# Altium schematic sheet iDAC2.SchDoc: Laser PCB
size A3; DrawnBy: James Singleton; Organization: TMC Technology Ltd.; DocumentNumber: 3; Revision: A; SheetNumber: 4; SheetTotal: 18; Drawn Date: 22/12/2020
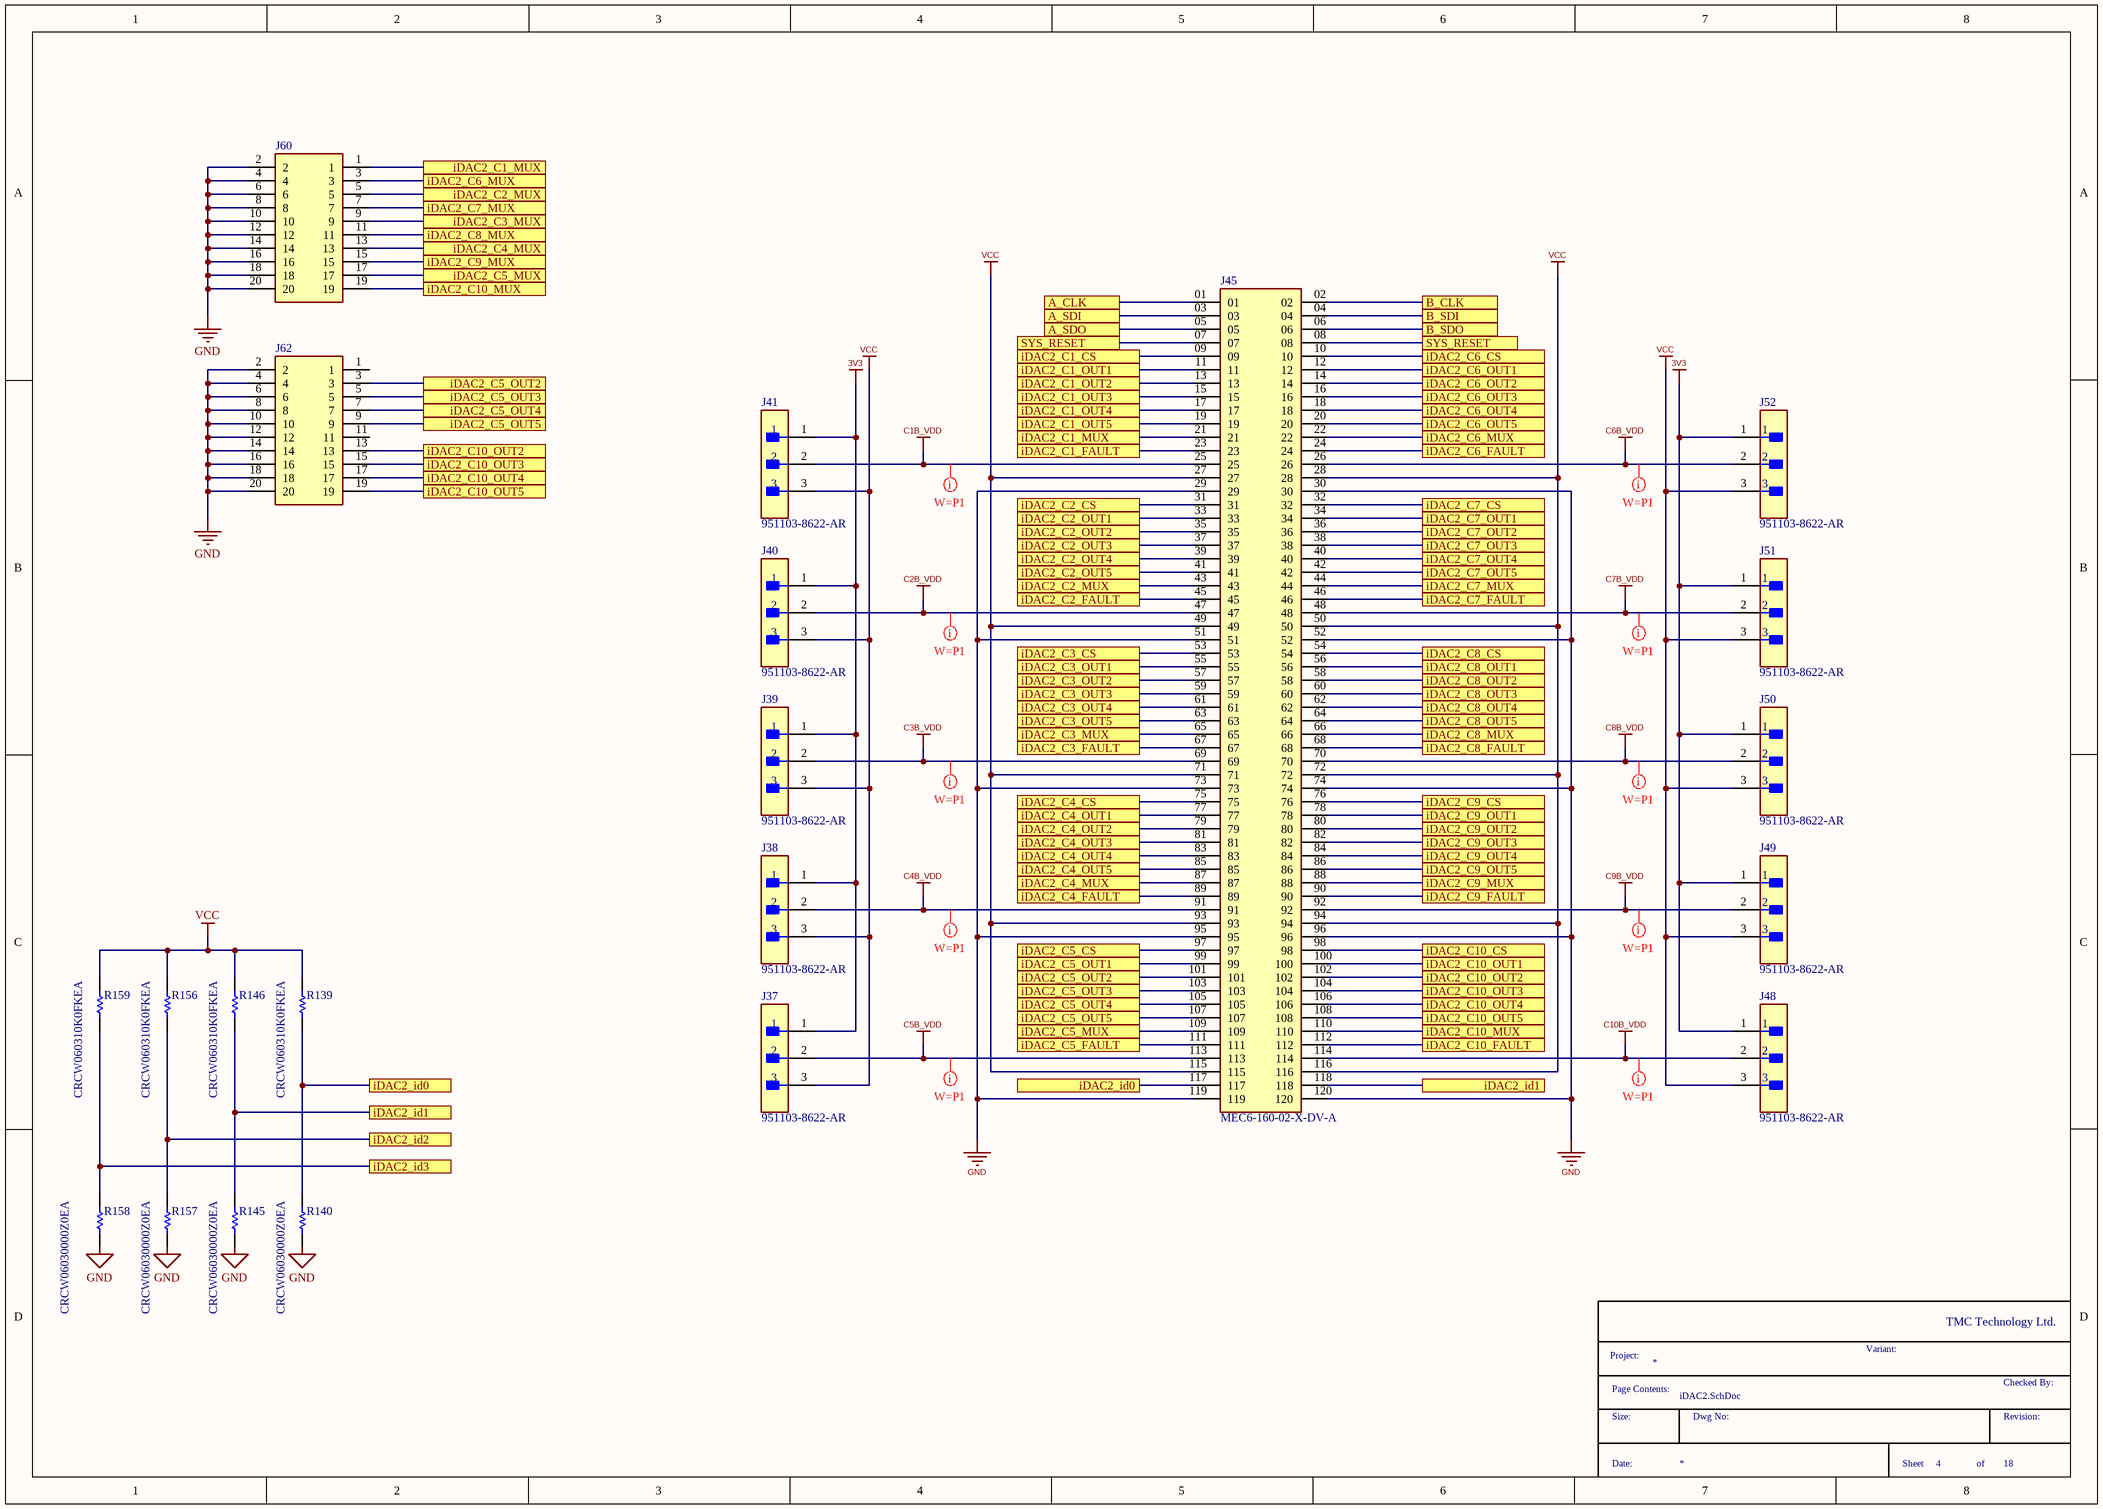
[diagram p0: iDAC2.SchDoc]

## Parts
J37  951103-8622-AR  [FP-951103-8622-AR-MFG]
J38  951103-8622-AR  [FP-951103-8622-AR-MFG]
J39  951103-8622-AR  [FP-951103-8622-AR-MFG]
J40  951103-8622-AR  [FP-951103-8622-AR-MFG]
J41  951103-8622-AR  [FP-951103-8622-AR-MFG]
J45  MEC6-160-02-X-DV-A  [SAMTEC_MEC6-160-02-X-DV-A]
J48  951103-8622-AR  [FP-951103-8622-AR-MFG]
J49  951103-8622-AR  [FP-951103-8622-AR-MFG]
J50  951103-8622-AR  [FP-951103-8622-AR-MFG]
J51  951103-8622-AR  [FP-951103-8622-AR-MFG]
J52  951103-8622-AR  [FP-951103-8622-AR-MFG]
J60  (no value)  [HDRV20W40P127_2X10_1270X340X550P]
J62  (no value)  [HDRV20W40P127_2X10_1270X340X550P]
R139  CRCW060310K0FKEA  [RESC1609X50X30NL8T20]
R140  CRCW06030000Z0EA  [RESC1609X50X30NL8T20]
R145  CRCW06030000Z0EA  [RESC1609X50X30NL8T20]
R146  CRCW060310K0FKEA  [RESC1609X50X30NL8T20]
R156  CRCW060310K0FKEA  [RESC1609X50X30NL8T20]
R157  CRCW06030000Z0EA  [RESC1609X50X30NL8T20]
R158  CRCW06030000Z0EA  [RESC1609X50X30NL8T20]
R159  CRCW060310K0FKEA  [RESC1609X50X30NL8T20]

## Ports
A_CLK (see iDAC1[4A], PI_INTERFACE[2B], vDAC1[4A], vDAC2[4A]), A_SDI (see iDAC1[4A], PI_INTERFACE[2B], vDAC1[4A], vDAC2[4A]), A_SDO (see iDAC1[4A], PI_INTERFACE[1B], vDAC1[4A], vDAC2[4A]), B_CLK (see iDAC1[6A], PI_INTERFACE[2B], vDAC1[5A], vDAC2[5A]), B_SDI (see iDAC1[6A], PI_INTERFACE[2B], vDAC1[5A], vDAC2[5A]), B_SDO (see iDAC1[6A], PI_INTERFACE[1B], vDAC1[5A], vDAC2[5A]), iDAC2_C1_CS (see ChipSelects+Faults[6B]), iDAC2_C1_FAULT (see ChipSelects+Faults[4B]), iDAC2_C1_MUX (see iDAC2[2A]), iDAC2_C1_MUX (see iDAC2[4B]), iDAC2_C1_OUT1 (see RX_FlexiConnectors[2C]), iDAC2_C1_OUT2 (see RX_FlexiConnectors[2C]), iDAC2_C1_OUT3 (see RX_FlexiConnectors[2C]), iDAC2_C1_OUT4 (see RX_FlexiConnectors[2C]), iDAC2_C1_OUT5 (see RX_FlexiConnectors[2C]), iDAC2_C2_CS (see ChipSelects+Faults[6B]), iDAC2_C2_FAULT (see ChipSelects+Faults[1B]), iDAC2_C2_MUX (see iDAC2[2A]), iDAC2_C2_MUX (see iDAC2[4B]), iDAC2_C2_OUT1 (see RX_FlexiConnectors[2C]), iDAC2_C2_OUT2 (see RX_FlexiConnectors[2C]), iDAC2_C2_OUT3 (see RX_FlexiConnectors[2C]), iDAC2_C2_OUT4 (see RX_FlexiConnectors[2C]), iDAC2_C2_OUT5 (see RX_FlexiConnectors[2C]), iDAC2_C3_CS (see ChipSelects+Faults[6C]), iDAC2_C3_FAULT (see ChipSelects+Faults[1B]), iDAC2_C3_MUX (see iDAC2[2A]), iDAC2_C3_MUX (see iDAC2[4B]), iDAC2_C3_OUT1 (see RX_FlexiConnectors[2C]), iDAC2_C3_OUT2 (see RX_FlexiConnectors[2C]), iDAC2_C3_OUT3 (see RX_FlexiConnectors[2C]), iDAC2_C3_OUT4 (see RX_FlexiConnectors[2C]), iDAC2_C3_OUT5 (see RX_FlexiConnectors[2C]), iDAC2_C4_CS (see ChipSelects+Faults[6C]), iDAC2_C4_FAULT (see ChipSelects+Faults[1B]), iDAC2_C4_MUX (see iDAC2[2A]), iDAC2_C4_MUX (see iDAC2[4C]), iDAC2_C4_OUT1 (see RX_FlexiConnectors[2C]), iDAC2_C4_OUT2 (see RX_FlexiConnectors[2C]), iDAC2_C4_OUT3 (see RX_FlexiConnectors[2B]), iDAC2_C4_OUT4 (see RX_FlexiConnectors[2B]), iDAC2_C4_OUT5 (see RX_FlexiConnectors[2B]), iDAC2_C5_CS (see ChipSelects+Faults[6C]), iDAC2_C5_FAULT (see ChipSelects+Faults[1C]), iDAC2_C5_MUX (see iDAC2[2A]), iDAC2_C5_MUX (see iDAC2[4C]), iDAC2_C5_OUT1 (see RX_FlexiConnectors[2B]), iDAC2_C5_OUT2 (see iDAC2[2B]), iDAC2_C5_OUT2 (see iDAC2[4C]), iDAC2_C5_OUT3 (see iDAC2[2B]), iDAC2_C5_OUT3 (see iDAC2[4C]), iDAC2_C5_OUT4 (see iDAC2[2B]), iDAC2_C5_OUT4 (see iDAC2[4C]), iDAC2_C5_OUT5 (see iDAC2[2B]), iDAC2_C5_OUT5 (see iDAC2[4C]), iDAC2_C6_CS (see ChipSelects+Faults[6C]), iDAC2_C6_FAULT (see ChipSelects+Faults[1C]), iDAC2_C6_MUX (see iDAC2[2A]), iDAC2_C6_MUX (see iDAC2[6B]), iDAC2_C6_OUT1 (see RX_FlexiConnectors[6C]), iDAC2_C6_OUT2 (see RX_FlexiConnectors[6C]), iDAC2_C6_OUT3 (see RX_FlexiConnectors[6C]), iDAC2_C6_OUT4 (see RX_FlexiConnectors[6C]), iDAC2_C6_OUT5 (see RX_FlexiConnectors[6C]), iDAC2_C7_CS (see ChipSelects+Faults[6C]), iDAC2_C7_FAULT (see ChipSelects+Faults[1C]), iDAC2_C7_MUX (see iDAC2[2A]), iDAC2_C7_MUX (see iDAC2[6B]), iDAC2_C7_OUT1 (see RX_FlexiConnectors[6C]), iDAC2_C7_OUT2 (see RX_FlexiConnectors[6C]), iDAC2_C7_OUT3 (see RX_FlexiConnectors[6C]), iDAC2_C7_OUT4 (see RX_FlexiConnectors[6C]), iDAC2_C7_OUT5 (see RX_FlexiConnectors[6C]), iDAC2_C8_CS (see ChipSelects+Faults[6C]), iDAC2_C8_FAULT (see ChipSelects+Faults[1C]), iDAC2_C8_MUX (see iDAC2[2A]), iDAC2_C8_MUX (see iDAC2[6B]), iDAC2_C8_OUT1 (see RX_FlexiConnectors[6C]), iDAC2_C8_OUT2 (see RX_FlexiConnectors[6C]), iDAC2_C8_OUT3 (see RX_FlexiConnectors[6C]), iDAC2_C8_OUT4 (see RX_FlexiConnectors[6C]), iDAC2_C8_OUT5 (see RX_FlexiConnectors[6C]), iDAC2_C9_CS (see ChipSelects+Faults[6C]), iDAC2_C9_FAULT (see ChipSelects+Faults[4C]), iDAC2_C9_MUX (see iDAC2[2A]), iDAC2_C9_MUX (see iDAC2[6C]), iDAC2_C9_OUT1 (see RX_FlexiConnectors[6C]), iDAC2_C9_OUT2 (see RX_FlexiConnectors[6C]), iDAC2_C9_OUT3 (see RX_FlexiConnectors[6B]), iDAC2_C9_OUT4 (see RX_FlexiConnectors[6B]), iDAC2_C9_OUT5 (see RX_FlexiConnectors[6B]), iDAC2_C10_CS (see ChipSelects+Faults[6C]), iDAC2_C10_FAULT (see ChipSelects+Faults[1C]), iDAC2_C10_MUX (see iDAC2[2A]), iDAC2_C10_MUX (see iDAC2[6C]), iDAC2_C10_OUT1 (see RX_FlexiConnectors[6B]), iDAC2_C10_OUT2 (see iDAC2[2B]), iDAC2_C10_OUT2 (see iDAC2[6C]), iDAC2_C10_OUT3 (see iDAC2[2B]), iDAC2_C10_OUT3 (see iDAC2[6C]), iDAC2_C10_OUT4 (see iDAC2[2B]), iDAC2_C10_OUT4 (see iDAC2[6C]), iDAC2_C10_OUT5 (see iDAC2[2B]), iDAC2_C10_OUT5 (see iDAC2[6C]), iDAC2_id0 (see ChipSelects+Faults[1C], iDAC2[2C]), iDAC2_id0 (see ChipSelects+Faults[1C], iDAC2[4C]), iDAC2_id1 (see iDAC2[2C]), iDAC2_id1 (see iDAC2[6C]), iDAC2_id2, iDAC2_id3, SYS_RESET (see iDAC1[4A], iDAC1[6A], iDAC2[4A], PI_INTERFACE[1C], PIO[5A], PIO[5D], PIO[7B], PIO[7C], vDAC1[4A], vDAC1[5A], vDAC2[3A], vDAC2[5A]), SYS_RESET (see iDAC1[4A], iDAC1[6A], iDAC2[6A], PI_INTERFACE[1C], PIO[5A], PIO[5D], PIO[7B], PIO[7C], vDAC1[4A], vDAC1[5A], vDAC2[3A], vDAC2[5A])

## Nets
3V3: J37.1 J38.1 J39.1 J40.1 J41.1 J48.1 J49.1 J50.1 J51.1 J52.1
C1B_VDD: J41.2 J45.25
C2B_VDD: J40.2 J45.47
C3B_VDD: J39.2 J45.69
C4B_VDD: J38.2 J45.91
C5B_VDD: J37.2 J45.113
C6B_VDD: J45.26 J52.2
C7B_VDD: J45.48 J51.2
C8B_VDD: J45.70 J50.2
C9B_VDD: J45.92 J49.2
C10B_VDD: J45.114 J48.2
GND: J45.29 J45.30 J45.51 J45.52 J45.73 J45.74 J45.95 J45.96 J45.119 J45.120 J60.2 J60.4 J60.6 J60.8 J60.10 J60.12 J60.14 J60.16 J60.18 J60.20 J62.2 J62.4 J62.6 J62.8 J62.10 J62.12 J62.14 J62.16 J62.18 J62.20 R140.1 R145.1 R157.1 R158.1
VCC: J37.3 J38.3 J39.3 J40.3 J41.3 J45.27 J45.28 J45.49 J45.50 J45.71 J45.72 J45.93 J45.94 J45.115 J45.116 J48.3 J49.3 J50.3 J51.3 J52.3 R139.2 R146.2 R156.2 R159.2
A_CLK: J45.01 ; port A_CLK
A_SDI: J45.03 ; port A_SDI
A_SDO: J45.05 ; port A_SDO
B_CLK: J45.02 ; port B_CLK
B_SDI: J45.04 ; port B_SDI
B_SDO: J45.06 ; port B_SDO
iDAC2_C1_CS: J45.09 ; port iDAC2_C1_CS
iDAC2_C1_FAULT: J45.23 ; port iDAC2_C1_FAULT
iDAC2_C1_MUX: J45.21 J60.1 ; port iDAC2_C1_MUX
iDAC2_C1_OUT1: J45.11 ; port iDAC2_C1_OUT1
iDAC2_C1_OUT2: J45.13 ; port iDAC2_C1_OUT2
iDAC2_C1_OUT3: J45.15 ; port iDAC2_C1_OUT3
iDAC2_C1_OUT4: J45.17 ; port iDAC2_C1_OUT4
iDAC2_C1_OUT5: J45.19 ; port iDAC2_C1_OUT5
iDAC2_C2_CS: J45.31 ; port iDAC2_C2_CS
iDAC2_C2_FAULT: J45.45 ; port iDAC2_C2_FAULT
iDAC2_C2_MUX: J45.43 J60.5 ; port iDAC2_C2_MUX
iDAC2_C2_OUT1: J45.33 ; port iDAC2_C2_OUT1
iDAC2_C2_OUT2: J45.35 ; port iDAC2_C2_OUT2
iDAC2_C2_OUT3: J45.37 ; port iDAC2_C2_OUT3
iDAC2_C2_OUT4: J45.39 ; port iDAC2_C2_OUT4
iDAC2_C2_OUT5: J45.41 ; port iDAC2_C2_OUT5
iDAC2_C3_CS: J45.53 ; port iDAC2_C3_CS
iDAC2_C3_FAULT: J45.67 ; port iDAC2_C3_FAULT
iDAC2_C3_MUX: J45.65 J60.9 ; port iDAC2_C3_MUX
iDAC2_C3_OUT1: J45.55 ; port iDAC2_C3_OUT1
iDAC2_C3_OUT2: J45.57 ; port iDAC2_C3_OUT2
iDAC2_C3_OUT3: J45.59 ; port iDAC2_C3_OUT3
iDAC2_C3_OUT4: J45.61 ; port iDAC2_C3_OUT4
iDAC2_C3_OUT5: J45.63 ; port iDAC2_C3_OUT5
iDAC2_C4_CS: J45.75 ; port iDAC2_C4_CS
iDAC2_C4_FAULT: J45.89 ; port iDAC2_C4_FAULT
iDAC2_C4_MUX: J45.87 J60.13 ; port iDAC2_C4_MUX
iDAC2_C4_OUT1: J45.77 ; port iDAC2_C4_OUT1
iDAC2_C4_OUT2: J45.79 ; port iDAC2_C4_OUT2
iDAC2_C4_OUT3: J45.81 ; port iDAC2_C4_OUT3
iDAC2_C4_OUT4: J45.83 ; port iDAC2_C4_OUT4
iDAC2_C4_OUT5: J45.85 ; port iDAC2_C4_OUT5
iDAC2_C5_CS: J45.97 ; port iDAC2_C5_CS
iDAC2_C5_FAULT: J45.111 ; port iDAC2_C5_FAULT
iDAC2_C5_MUX: J45.109 J60.17 ; port iDAC2_C5_MUX
iDAC2_C5_OUT1: J45.99 ; port iDAC2_C5_OUT1
iDAC2_C5_OUT2: J45.101 J62.3 ; port iDAC2_C5_OUT2
iDAC2_C5_OUT3: J45.103 J62.5 ; port iDAC2_C5_OUT3
iDAC2_C5_OUT4: J45.105 J62.7 ; port iDAC2_C5_OUT4
iDAC2_C5_OUT5: J45.107 J62.9 ; port iDAC2_C5_OUT5
iDAC2_C6_CS: J45.10 ; port iDAC2_C6_CS
iDAC2_C6_FAULT: J45.24 ; port iDAC2_C6_FAULT
iDAC2_C6_MUX: J45.22 J60.3 ; port iDAC2_C6_MUX
iDAC2_C6_OUT1: J45.12 ; port iDAC2_C6_OUT1
iDAC2_C6_OUT2: J45.14 ; port iDAC2_C6_OUT2
iDAC2_C6_OUT3: J45.16 ; port iDAC2_C6_OUT3
iDAC2_C6_OUT4: J45.18 ; port iDAC2_C6_OUT4
iDAC2_C6_OUT5: J45.20 ; port iDAC2_C6_OUT5
iDAC2_C7_CS: J45.32 ; port iDAC2_C7_CS
iDAC2_C7_FAULT: J45.46 ; port iDAC2_C7_FAULT
iDAC2_C7_MUX: J45.44 J60.7 ; port iDAC2_C7_MUX
iDAC2_C7_OUT1: J45.34 ; port iDAC2_C7_OUT1
iDAC2_C7_OUT2: J45.36 ; port iDAC2_C7_OUT2
iDAC2_C7_OUT3: J45.38 ; port iDAC2_C7_OUT3
iDAC2_C7_OUT4: J45.40 ; port iDAC2_C7_OUT4
iDAC2_C7_OUT5: J45.42 ; port iDAC2_C7_OUT5
iDAC2_C8_CS: J45.54 ; port iDAC2_C8_CS
iDAC2_C8_FAULT: J45.68 ; port iDAC2_C8_FAULT
iDAC2_C8_MUX: J45.66 J60.11 ; port iDAC2_C8_MUX
iDAC2_C8_OUT1: J45.56 ; port iDAC2_C8_OUT1
iDAC2_C8_OUT2: J45.58 ; port iDAC2_C8_OUT2
iDAC2_C8_OUT3: J45.60 ; port iDAC2_C8_OUT3
iDAC2_C8_OUT4: J45.62 ; port iDAC2_C8_OUT4
iDAC2_C8_OUT5: J45.64 ; port iDAC2_C8_OUT5
iDAC2_C9_CS: J45.76 ; port iDAC2_C9_CS
iDAC2_C9_FAULT: J45.90 ; port iDAC2_C9_FAULT
iDAC2_C9_MUX: J45.88 J60.15 ; port iDAC2_C9_MUX
iDAC2_C9_OUT1: J45.78 ; port iDAC2_C9_OUT1
iDAC2_C9_OUT2: J45.80 ; port iDAC2_C9_OUT2
iDAC2_C9_OUT3: J45.82 ; port iDAC2_C9_OUT3
iDAC2_C9_OUT4: J45.84 ; port iDAC2_C9_OUT4
iDAC2_C9_OUT5: J45.86 ; port iDAC2_C9_OUT5
iDAC2_C10_CS: J45.98 ; port iDAC2_C10_CS
iDAC2_C10_FAULT: J45.112 ; port iDAC2_C10_FAULT
iDAC2_C10_MUX: J45.110 J60.19 ; port iDAC2_C10_MUX
iDAC2_C10_OUT1: J45.100 ; port iDAC2_C10_OUT1
iDAC2_C10_OUT2: J45.102 J62.13 ; port iDAC2_C10_OUT2
iDAC2_C10_OUT3: J45.104 J62.15 ; port iDAC2_C10_OUT3
iDAC2_C10_OUT4: J45.106 J62.17 ; port iDAC2_C10_OUT4
iDAC2_C10_OUT5: J45.108 J62.19 ; port iDAC2_C10_OUT5
iDAC2_id0: J45.117 R139.1 R140.2 ; port iDAC2_id0
iDAC2_id1: J45.118 R145.2 R146.1 ; port iDAC2_id1
iDAC2_id2: R156.1 R157.2 ; port iDAC2_id2
iDAC2_id3: R158.2 R159.1 ; port iDAC2_id3
SYS_RESET: J45.07 J45.08 ; port SYS_RESET

Not connected (* = marked no-connect by the designer): J62 1 11

## Layout directives
mark named W=P1: C1B_VDD, C2B_VDD, C3B_VDD, C4B_VDD, C5B_VDD, C6B_VDD, C7B_VDD, C8B_VDD, C9B_VDD, C10B_VDD

## Notes on the sheet
- TMC Technology Ltd.
- Page Contents:
- Project:
- Variant:
- Checked By:
- Size:
- Date:
- Dwg No:
- Sheet
- of
- Revision:

## Library data of the parts
J37-J41 J48-J52 = CMP-05379-000003-1: CONN HEADER VERT 3POS 2MM; Manufacturer: 3M; Conn Gender: Male; Current Rating: 2A; Number Of Contacts: 3; Conn Orientation: Straight; Height: 6.3mm; Digikey Description: CONN HEADER VERT 3POS 2MM; Device Class L3: unset; Category: Conn; Manufacturer Part Number: 951103-8622-AR; RoHS: TRUE; Contact Material: Gold,Nickel; ComponentLink2Description: Datasheet; Temperature Range Low: -55°C; Device Class L1: Connectors; Pitch: 2mm; Mouser Description: Header; PinStrip; CopperAlloy; HighTempThermoplastic; 3Cnts; 1A; RtAngle; 951Series; Octopart: https://octopart.com/951103-8622-ar-3m-14400669; Package: 951103-8622-AR; Lead Free: Yes; Device Class L2: Headers and Wire Housings; Temperature Range High: +125°C; ComponentLink2URL: http://multimedia.3m.com/mws/media/1400506O/3m-pin-strip-header-951-series-78-5100-2653-3.pdf; Automotive: No; Temperature: -55°C to +125°C; Number Of Rows: 1
J45 = MEC6-160-02-X-DV-A: MF: Samtec Inc.; System: Connector; Value: *; Price: None; Package: None; Availability: Unavailable; MP: MEC6-160-02-X-DV-A
J60 J62 = 20021111-00020T4LF: Connector; Manufacturer_Name: FCI Electronics; Datasheet Link: https://media.digikey.com/pdf/Data%20Sheets/FCI%20PDFs/Minitek%20127_Catalog.pdf; Height: 5.5mm; Manufacturer_Part_Number: 20021111-00020T4LF
R139 R146 R156 R159 = CMP-1666-00005-4: Chip Resistor, 10 KOhm, +/- 1%, 100 mW, -55 to 155 degC, 0603 (1608 Metric), RoHS, Tape and Reel; Manufacturer: Vishay Semiconductor; Voltage Rating: 75 V; Max Operating Temperature: 155 degC; PackageDescription: 2-Pin Surface Mount Device, Body 1.575 x 0.85 mm; ComponentLink1Description: Manufacturer URL; RoHSCompliant: true; PackageReference: 0603; REACH SVHC: Unknown; Length: 1.55 mm; DatasheetVersion: 06/2012; Packaging: Tape and Reel; Min Operating Temperature: -55 degC; Mounting Technology: Surface Mount; ComponentLink2URL: https://datasheet.ciiva.com/11809/0900766b80d98afc-11809037.pdf; Height: 0.45 mm; ComponentLink2Description: Datasheet; Package Quantity: 5000; ComponentLink1URL: http://www.vishay.com/
R140 R145 R157 R158 = CMP-2000-03816-5: Chip Resistor, 0 Ohm, Jumper, 100 mW, -55 to 155 degC, 0603 (1608 Metric), RoHS, Tape and Reel; Manufacturer: Vishay Semiconductor; Voltage Rating: 75 V; Package Quantity: 5000; DatasheetVersion: 06/2012; Min Operating Temperature: -55 degC; ComponentLink1URL: http://www.vishay.com/; Mounting Technology: Surface Mount; Height: 0.45 mm; ComponentLink1Description: Manufacturer URL; REACH SVHC: Unknown; PackageReference: 0603; Packaging: Tape and Reel; Max Operating Temperature: 155 degC; Mount: Surface Mount; ComponentLink2Description: Datasheet; PackageDescription: 2-Pin Surface Mount Device, Body 1.575 x 0.85 mm; Length: 1.55 mm; ComponentLink2URL: http://www.vishay.com/docs/20035/dcrcwe3.pdf; Pins: 2; RoHSCompliant: true